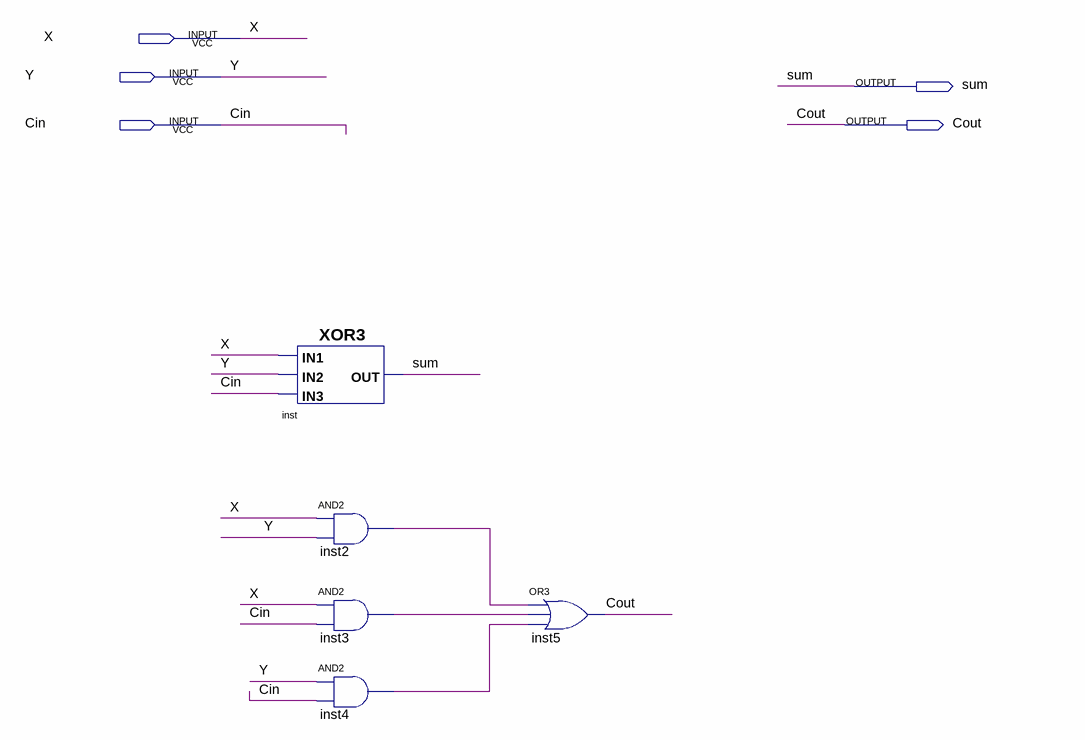
[diagram p0: schematic sheet]
// Quartus schematic fulladder.bdf as structural Verilog: 5 symbols, 5 pins
module fulladder (
  input  X,
  input  Y,
  input  Cin,
  output sum,
  output Cout
);

  wire inst2_out, inst3_out, inst4_out;

  XOR3 inst (.IN3(Cin), .IN1(X), .IN2(Y), .OUT(sum));
  and inst2 (inst2_out, X, Y);
  and inst3 (inst3_out, X, Cin);
  and inst4 (inst4_out, Y, Cin);
  or inst5 (Cout, inst2_out, inst3_out, inst4_out);
endmodule
